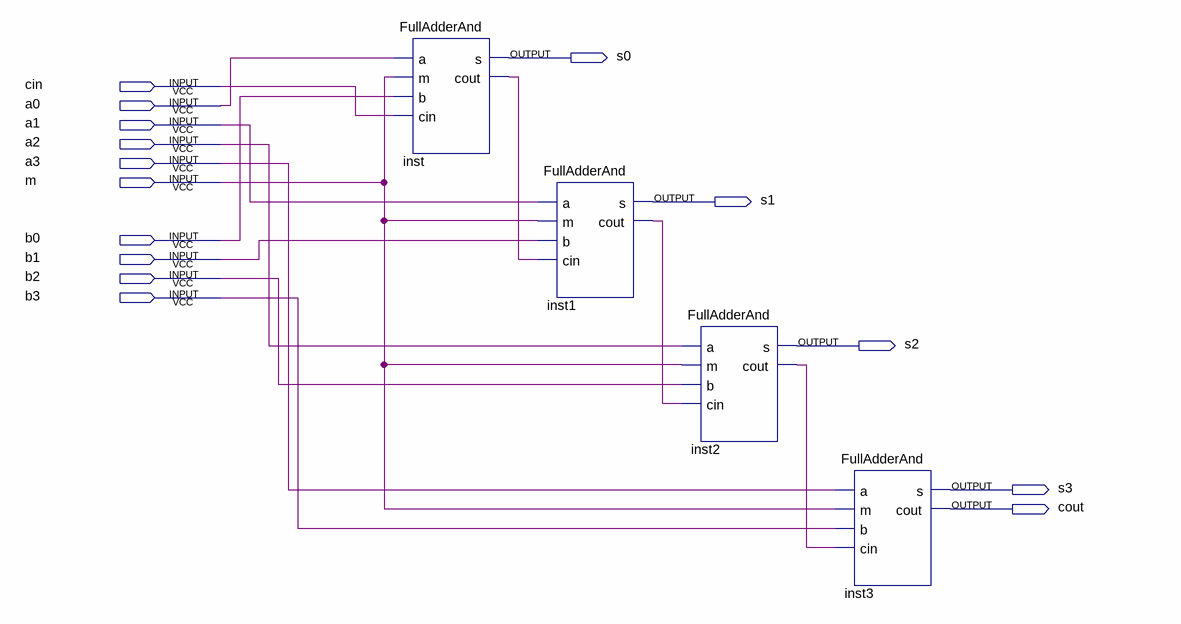
[diagram p0: schematic sheet]
// Quartus schematic 4BMAdder.bdf as structural Verilog: 4 symbols, 15 pins
module \4BMAdder  (
  input  cin,
  input  a0,
  input  a1,
  input  a2,
  input  a3,
  input  m,
  input  b0,
  input  b1,
  input  b2,
  input  b3,
  output s0,
  output s1,
  output s2,
  output s3,
  output cout
);

  wire inst1_cout, inst2_cout, inst_cout;

  FullAdderAnd inst (.a(a0), .m(m), .b(b0), .cin(cin), .s(s0), .cout(inst_cout));
  FullAdderAnd inst1 (.a(a1), .m(m), .b(b1), .cin(inst_cout), .s(s1), .cout(inst1_cout));
  FullAdderAnd inst2 (.a(a2), .m(m), .b(b2), .cin(inst1_cout), .s(s2), .cout(inst2_cout));
  FullAdderAnd inst3 (.a(a3), .m(m), .b(b3), .cin(inst2_cout), .s(s3), .cout(cout));
endmodule
